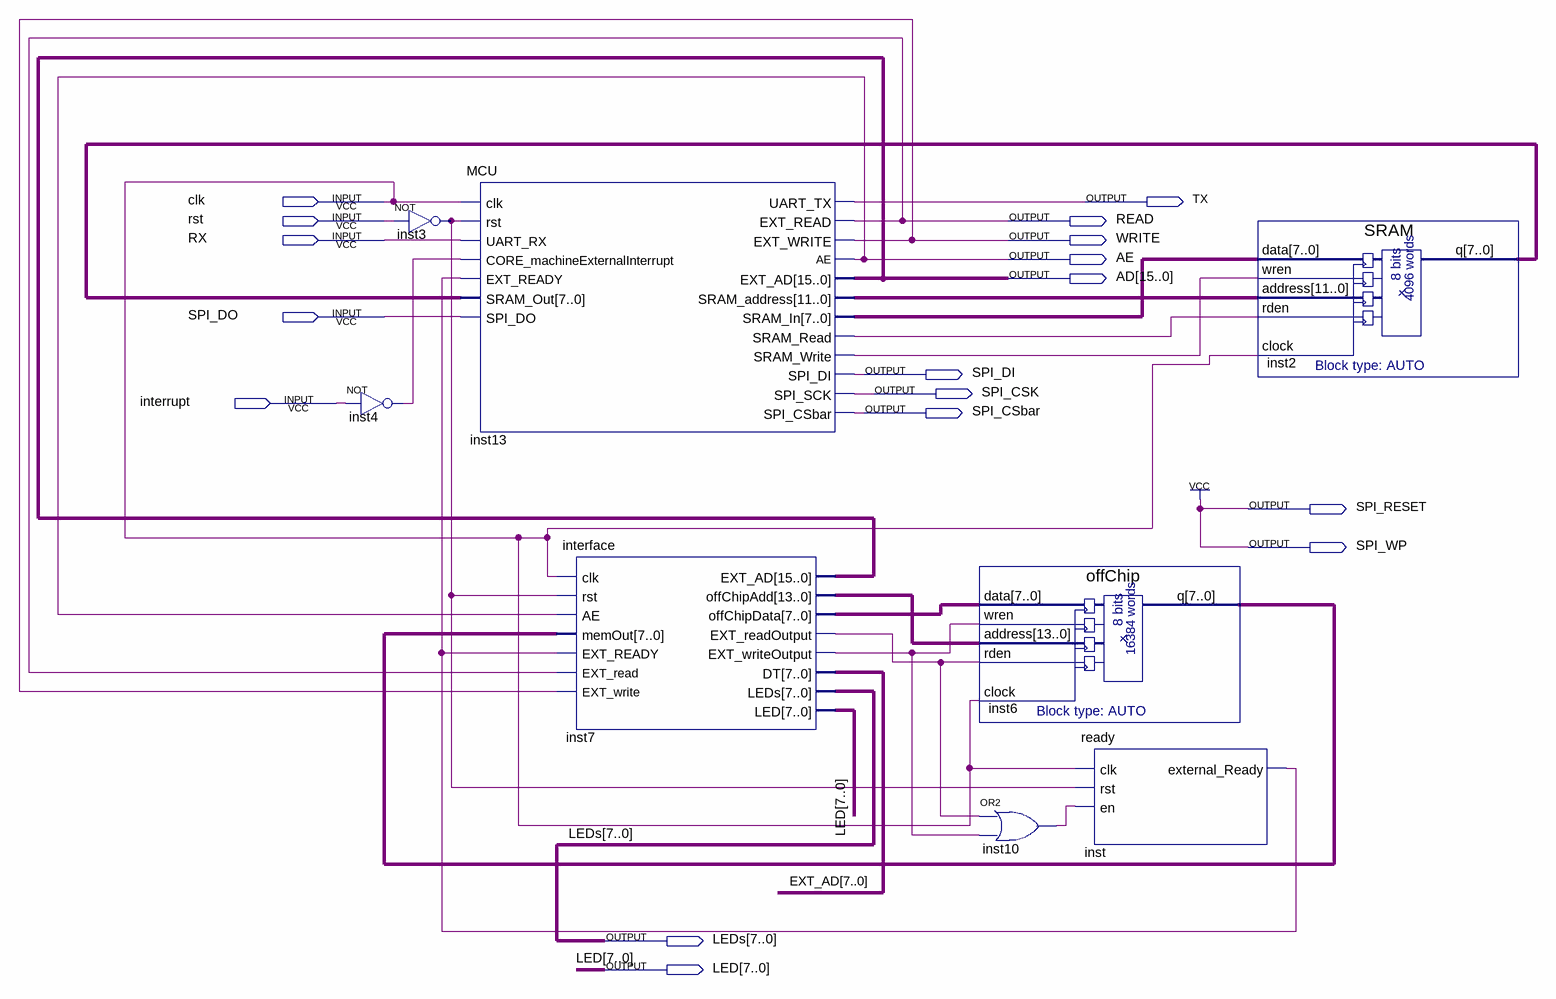
[diagram p0: schematic sheet]
// Quartus schematic MCU_schematic.bdf as structural Verilog: 8 symbols, 17 pins
module MCU_schematic (
  input  clk,
  input  rst,
  input  RX,
  input  SPI_DO,
  input  interrupt,
  output TX,
  output READ,
  output WRITE,
  output AE,
  output [15:0] AD,
  output SPI_DI,
  output SPI_CSK,
  output SPI_CSbar,
  output SPI_RESET,
  output SPI_WP,
  output [7:0] LEDs,
  output [7:0] LED
);

  wire inst3_out, inst4_out, inst7_ext_readoutput, inst7_ext_writeoutput, inst10_out, inst13_sram_read,
       inst13_sram_write, inst_external_ready;
  wire [7:0] EXT_AD, inst2_q, inst6_q, inst7_offchipdata, inst13_sram_in;
  wire [11:0] inst13_sram_address;
  wire [13:0] inst7_offchipadd;

  not inst4 (inst4_out, interrupt);
  not inst3 (inst3_out, rst);
  MCU inst13 (
    .clk(clk), .rst(inst3_out), .UART_RX(RX), .CORE_machineExternalInterrupt(inst4_out),
    .EXT_READY(inst_external_ready), .SRAM_Out(inst2_q), .SPI_DO(SPI_DO), .UART_TX(TX), .EXT_READ(READ),
    .EXT_WRITE(WRITE), .AE(AE), .SRAM_address(inst13_sram_address), .SRAM_In(inst13_sram_in),
    .SRAM_Read(inst13_sram_read), .SRAM_Write(inst13_sram_write), .SPI_DI(SPI_DI), .SPI_SCK(SPI_CSK),
    .SPI_CSbar(SPI_CSbar), .EXT_AD(AD));
  \interface  inst7 (
    .clk(clk), .rst(inst3_out), .AE(AE), .memOut(inst6_q), .EXT_READY(inst_external_ready), .EXT_read(READ),
    .EXT_write(WRITE), .offChipAdd(inst7_offchipadd), .offChipData(inst7_offchipdata),
    .EXT_readOutput(inst7_ext_readoutput), .EXT_writeOutput(inst7_ext_writeoutput), .DT(EXT_AD), .LEDs(LEDs),
    .LED(LED), .EXT_AD(AD));
  offChip inst6 (
    .data(inst7_offchipdata), .wren(inst7_ext_writeoutput), .address(inst7_offchipadd),
    .rden(inst7_ext_readoutput), .clock(clk), .q(inst6_q));
  or inst10 (inst10_out, inst7_ext_readoutput, inst7_ext_writeoutput);
  ready inst (.clk(clk), .rst(inst3_out), .en(inst10_out), .external_Ready(inst_external_ready));
  SRAM inst2 (
    .data(inst13_sram_in), .wren(inst13_sram_write), .address(inst13_sram_address), .rden(inst13_sram_read),
    .clock(clk), .q(inst2_q));

  assign SPI_RESET = 1'b1;
  assign SPI_WP = 1'b1;
endmodule
